# EAGLE design LB_BIT_i36_MICROSEQUENCER-v03(6_7) (EAGLE 6.6.0)
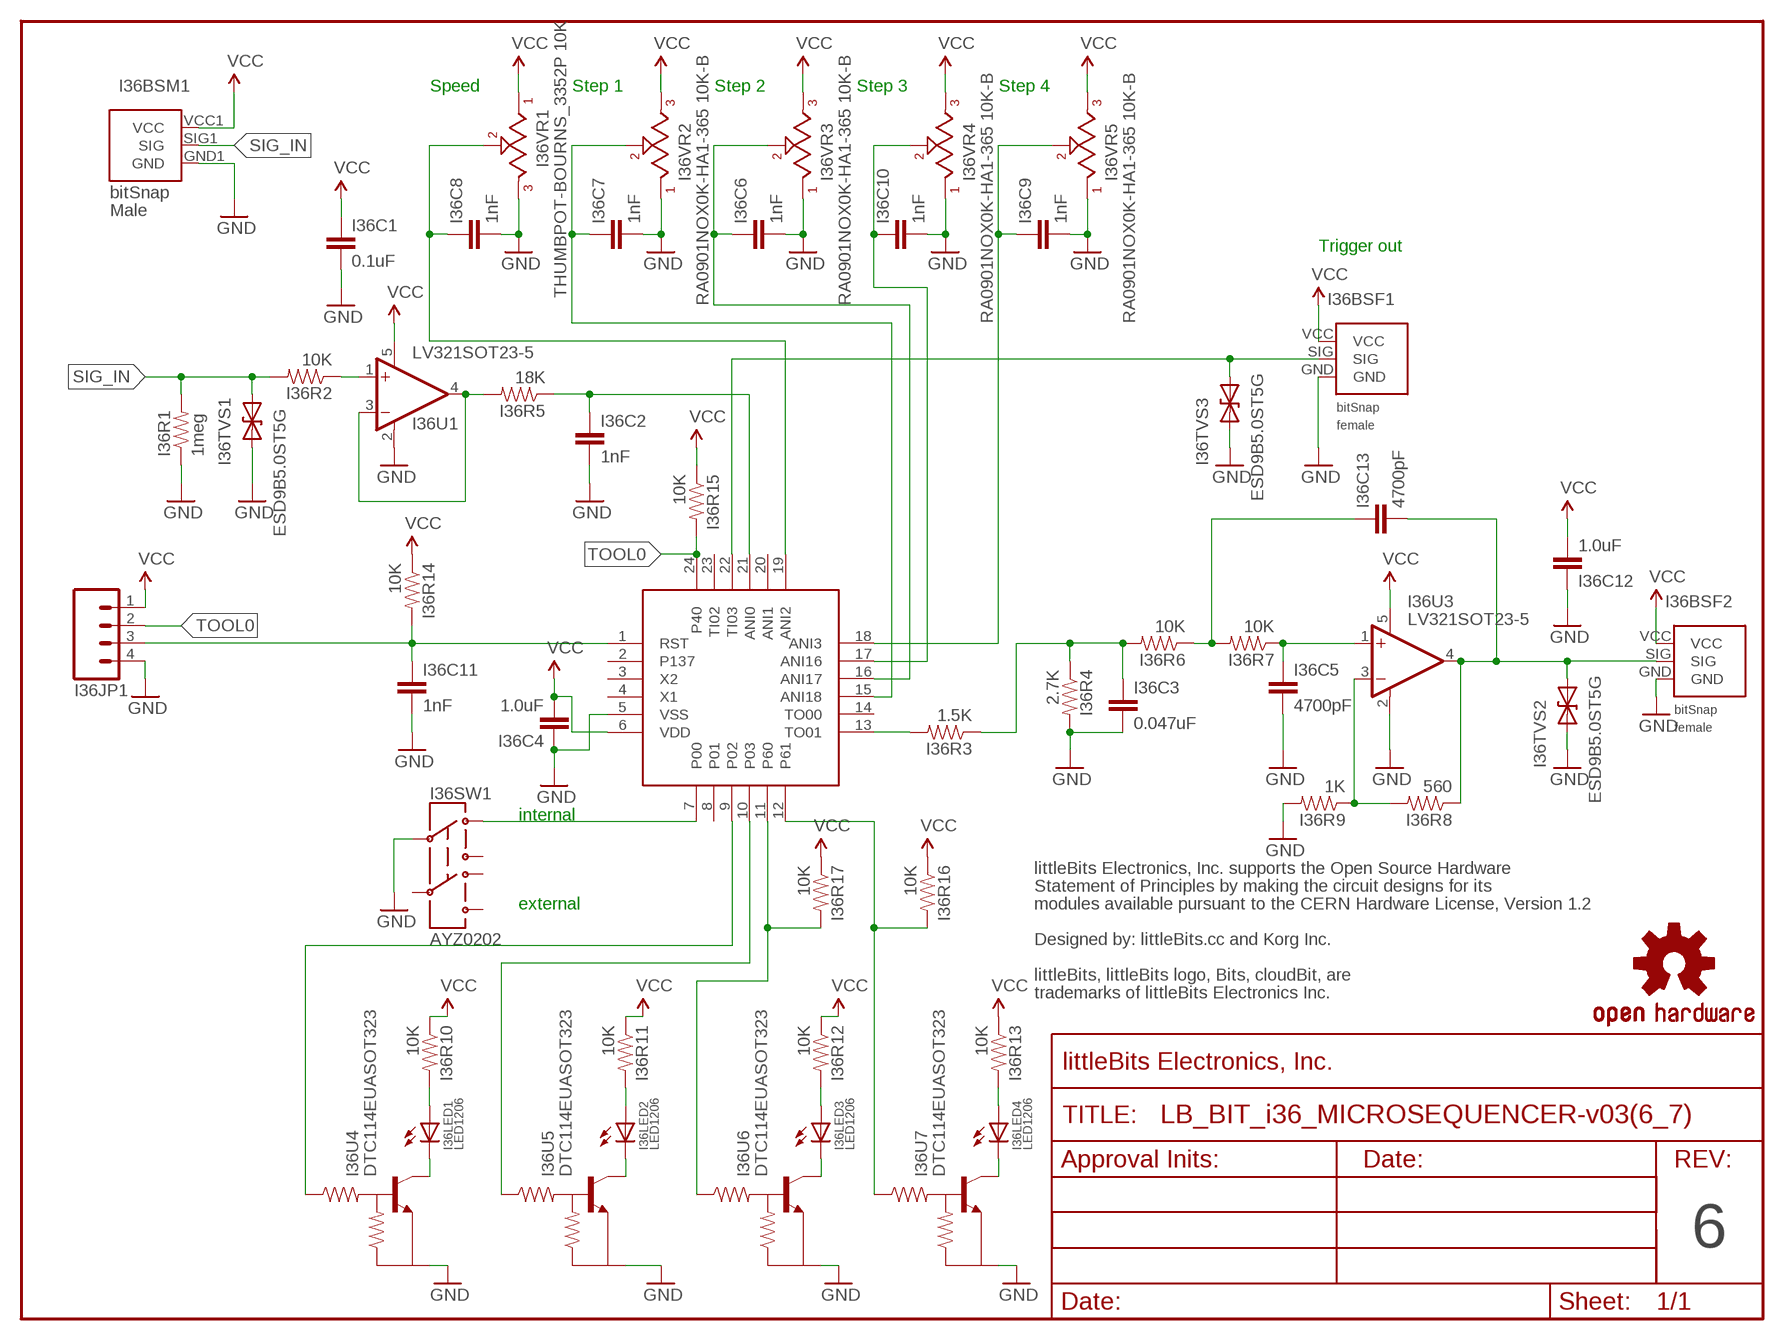
[diagram p0: schematic, sheet 1]

## Parts
I36BSF1  BITSNAP_V03_FEMALE  [BITSNAP_V03_FEMALE]
I36BSF2  BITSNAP_V03_FEMALE  [BITSNAP_V03_FEMALE]
I36BSM1  BITSNAP_V03_MALE  [BITSNAP_V03_MALE]
I36C1  0.1uF  CAPCAP-0603  [CAP-0603]
I36C2  1nF  CAPCAP-0603  [CAP-0603]
I36C3  0.047uF  CAPCAP-0603  [CAP-0603]
I36C4  1.0uF  CAPCAP-0603  [CAP-0603]
I36C5  4700pF  CAPCAP-0603  [CAP-0603]
I36C6  1nF  CAPCAP-0603  [CAP-0603]
I36C7  1nF  CAPCAP-0603  [CAP-0603]
I36C8  1nF  CAPCAP-0603  [CAP-0603]
I36C9  1nF  CAPCAP-0603  [CAP-0603]
I36C10  1nF  CAPCAP-0603  [CAP-0603]
I36C11  1nF  CAPCAP-0603  [CAP-0603]
I36C12  1.0uF  CAPCAP-0603  [CAP-0603]
I36C13  4700pF  CAPCAP-0603  [CAP-0603]
I36JP1  HDR-4SM_SML  [SIP4-SM-0.1IN-NOS.S.]
I36LED1  LED1206  [LED-1206]
I36LED2  LED1206  [LED-1206]
I36LED3  LED1206  [LED-1206]
I36LED4  LED1206  [LED-1206]
I36R1  1meg  RESISTOR0603  [RES-0603]
I36R2  10K  RESISTOR0603  [RES-0603]
I36R3  1.5K  RESISTOR0603  [RES-0603]
I36R4  2.7K  RESISTOR0603  [RES-0603]
I36R5  18K  RESISTOR0603  [RES-0603]
I36R6  10K  RESISTOR0603  [RES-0603]
I36R7  10K  RESISTOR0603  [RES-0603]
I36R8  560  RESISTOR0603  [RES-0603]
I36R9  1K  RESISTOR0603  [RES-0603]
I36R10  10K  RESISTOR0603  [RES-0603]
I36R11  10K  RESISTOR0603  [RES-0603]
I36R12  10K  RESISTOR0603  [RES-0603]
I36R13  10K  RESISTOR0603  [RES-0603]
I36R14  10K  RESISTOR0603  [RES-0603]
I36R15  10K  RESISTOR0603  [RES-0603]
I36R16  10K  RESISTOR0603  [RES-0603]
I36R17  10K  RESISTOR0603  [RES-0603]
I36SW1  AYZ0202  [AYZ0202]
I36TVS1  ESD9B5.0ST5G  DIODE-TVSSOD-923  [SOD-923]
I36TVS2  ESD9B5.0ST5G  DIODE-TVSSOD-923  [SOD-923]
I36TVS3  ESD9B5.0ST5G  DIODE-TVSSOD-923  [SOD-923]
I36U1  LV321SOT23-5  [SOT23-5]
I36U2  R5F10278QFN-24  [QFN-24(4MM)]
I36U3  LV321SOT23-5  [SOT23-5]
I36U4  DTC114EUASOT323  [SOT323]
I36U5  DTC114EUASOT323  [SOT323]
I36U6  DTC114EUASOT323  [SOT323]
I36U7  DTC114EUASOT323  [SOT323]
I36VR1  THUMBPOT-BOURNS_3352P 10K  THUMBPOT-BOURNS_3352P  [THUMBPOT-BOURNS_3352]
I36VR2  RA0901NOX0K-HA1-365 10K-B  ALPS_POTTH  [ALPS_POT]
I36VR3  RA0901NOX0K-HA1-365 10K-B  ALPS_POTTH  [ALPS_POT]
I36VR4  RA0901NOX0K-HA1-365 10K-B  ALPS_POTTH  [ALPS_POT]
I36VR5  RA0901NOX0K-HA1-365 10K-B  ALPS_POTTH  [ALPS_POT]
U$1  OSHWCREDIT-KORG  [OSHWCREDIT-KORG]
U$2  OSHW-LOGOL  [OSHW-LOGO-L]
U$3  FRAME-LETTER-OHWOHW  [FABDWG01-OHW]

## Nets
GND: I36BSF1.GND I36BSF2.GND I36BSM1.GND1(GND) I36C1.2 I36C2.2 I36C3.2 I36C4.1 I36C5.2 I36C6.2 I36C7.2 I36C8.2 I36C9.2 I36C10.2 I36C11.2 I36C12.1 I36JP1.4 I36R1.1 I36R4.2 I36R9.2 I36SW1.2 I36TVS1.1(A) I36TVS2.1(A) I36TVS3.1(A) I36U1.2(V-) I36U2.5(VSS) I36U3.2(V-) I36U4.GND(E) I36U5.GND(E) I36U6.GND(E) I36U7.GND(E) I36VR1.1 I36VR2.1 I36VR3.1 I36VR4.1 I36VR5.1
N$1: I36C2.1 I36R5.1 I36U2.21(ANI0)
N$2: I36R5.2 I36U1.3(-IN) I36U1.4(OUT)
N$3: I36C3.1 I36R3.1 I36R4.1 I36R6.2
N$4: I36R2.1 I36U1.1(+IN)
N$5: I36R3.2 I36U2.13(TO01)
N$6: I36R8.2 I36R9.1 I36U3.3(-IN)
N$7: I36C13.1 I36R6.1 I36R7.2
N$8: I36BSF1.SIG I36TVS3.2(C) I36U2.22(TI03)
N$10: I36C5.1 I36R7.1 I36U3.1(+IN)
N$11: I36SW1.1 I36U2.7(P00)
N$13: I36C7.1 I36U2.15(ANI18) I36VR2.2
N$14: I36C6.1 I36U2.16(ANI17) I36VR3.2
N$15: I36U2.9(P02) I36U4.IN
N$16: I36U2.10(P03) I36U5.IN
N$17: I36R17.2 I36U2.11(P60) I36U6.IN
N$18: I36R16.2 I36U2.12(P61) I36U7.IN
N$19: I36LED1.A I36R10.2
N$20: I36LED1.C I36U4.OUT(C)
N$21: I36LED2.A I36R11.2
N$22: I36LED2.C I36U5.OUT(C)
N$23: I36LED3.A I36R12.2
N$24: I36LED3.C I36U6.OUT(C)
N$25: I36LED4.A I36R13.2
N$26: I36LED4.C I36U7.OUT(C)
N$27: I36C8.1 I36U2.19(ANI2) I36VR1.2
N$28: I36C10.1 I36U2.17(ANI16) I36VR4.2
N$30: I36C9.1 I36U2.18(ANI3) I36VR5.2
N$31: I36C11.1 I36JP1.3 I36R14.2 I36U2.1(RST)
SIG_IN: I36BSM1.SIG1(SIG) I36R1.2 I36R2.2 I36TVS1.2(C)
SIG_OUT: I36BSF2.SIG I36C13.2 I36R8.1 I36TVS2.2(C) I36U3.4(OUT)
TOOL0: I36JP1.2 I36R15.2 I36U2.24(P40)
VCC: I36BSF1.VCC I36BSF2.VCC I36BSM1.VCC1(VCC) I36C1.1 I36C4.2 I36C12.2 I36JP1.1 I36R10.1 I36R11.1 I36R12.1 I36R13.1 I36R14.1 I36R15.1 I36R16.1 I36R17.1 I36U1.5(V+) I36U2.6(VDD) I36U3.5(V+) I36VR1.3 I36VR2.3 I36VR3.3 I36VR4.3 I36VR5.3
Unconnected: I36SW1.3 I36SW1.4 I36SW1.5 I36SW1.6 I36U2.2(P137) I36U2.3(X2) I36U2.4(X1) I36U2.8(P01) I36U2.14(TO00) I36U2.20(ANI1) I36U2.23(TI02)

## Notes on the sheet
- Speed | Step 1 | Step 2 | Step 3 | Step 4
- Trigger out
- internal
- external
- 6

## Library data of the parts
I36BSF1 I36BSF2 = bitSnap:BITSNAP_V03_FEMALE
I36BSM1 = bitSnap:BITSNAP_V03_MALE
I36C1-I36C13 = LITTLEBITS:CAP
I36JP1 = LITTLEBITS:HDR-4: Header 4 Standard 4-pin 0.1" header. Use with straight break away headers (SKU : PRT-00116), right angle break away headers (PRT-00553), swiss pins (PRT-00743), machine pins (PRT-00117), and female headers (PRT-00115). Molex polarized connector foot print use with SKU : PRT-08231 with associated crimp pins and housings.
I36LED1-I36LED4 = LITTLEBITS:LED
I36R1-I36R17 = LITTLEBITS:RESISTOR
I36SW1 = LITTLEBITS:AYZ0202
I36TVS1-I36TVS3 = LITTLEBITS:DIODE-TVS: Bidirectional Transient Voltage Suppression Diode: Device conducts in avalanche mode after reaching a part dependent voltage threshold. Used for limiting voltage spikes on ESD sensitive inputs and outputs.; IEC_ESD_PROT0: +/-18kV; LB_PN: ?; MPN: ESD9B5.0ST5G; V_CLAMP: ?; V_OPERATION: 5V
I36U1 I36U3 = LITTLEBITS:LV321
I36U2 = LITTLEBITS:R5F10278
I36U4-I36U7 = LITTLEBITS:DTC114EUA
I36VR1 = LITTLEBITS:THUMBPOT-BOURNS_3352
I36VR2-I36VR5 = LITTLEBITS:ALPS_POT
U$1 = LITTLEBITS:OSHWCREDIT-KORG
U$2 = LITTLEBITS:OSHW-LOGO: Open Source Hardware Logo This logo indicates the piece of hardware it is found on incorporates a OSHW license and/or adheres to the definition of open source hardware found here: http://freedomdefined.org/OSHW
U$3 = LITTLEBITS:FRAME-LETTER-OHW

## Board
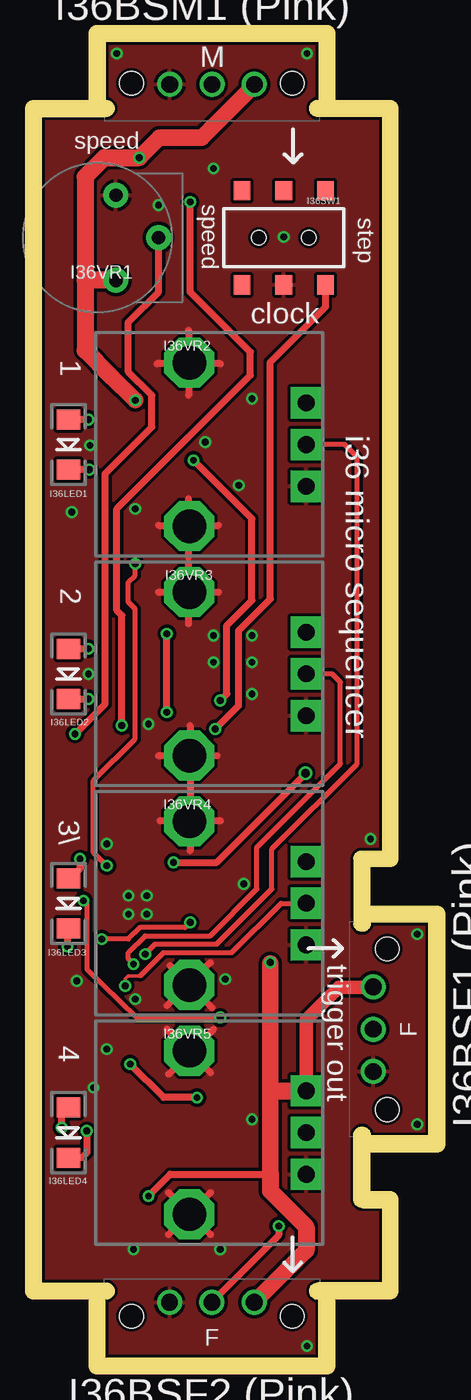
[diagram p1: board, top side]
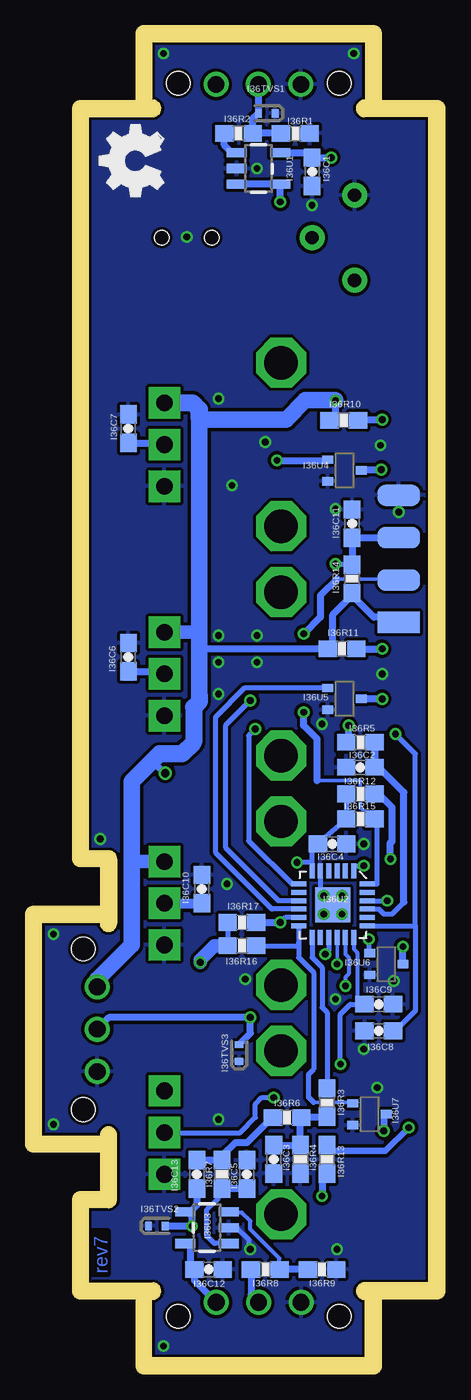
[diagram p2: board, bottom side, seen from below]

Size 23.2 x 78.9 mm. Coordinates in mm from the lower left corner, seen from the top.
Outline: 0,4.5 0,74.4
Outline: 20.4,74.4 20.4,30.4 19.2,30.4 arc90 18.7,29.9
Outline: 20.4,4.5 20.4,9 19.2,9 arc-90 18.7,9.5
Copper layers (1*16): Top 0.035mm / dielectric 1.5mm / Bottom 0.035mm
Design rules "littleBitsDRC": minimum track width 0.2mm, minimum drill 0.4mm, track to track 0.2mm, track to pad 0.2mm, pad to pad 0.2mm, via to via 0.2mm, smd to smd 0mil, copper to edge 0.2mm, drill to drill 0.2mm, minimum pad ring 0.2mm, minimum via ring 0.15mm, stop-mask expansion 0.1mm, vias tented up to drill 0mil, thermal gap 0.2mm
Milling: 9 lines

### Footprints (pad centres in the part's own frame; a part is rotated, then mirrored left to right if it is on the bottom)
BITSNAP_V03_FEMALE = drill 1: GND 3.91,3.33; SIG 6.45,3.33; VCC 8.99,3.33 | hole 1.4: 1.63,2.5; 11.27,2.5
BITSNAP_V03_MALE = drill 1: GND1 8.98,2.56; SIG1 6.44,2.56; VCC1 3.9,2.56 | hole 1.4: 11.27,2.5; 1.63,2.5
CAP-0603 = smd 1.1 x 1: 1 -0.85,0; 2 0.85,0
SIP4-SM-0.1IN-NOS.S. = smd 1.27 x 2.54: 1 -3.81,0; 2 -1.27,0; 3 1.27,0; 4 3.81,0
LED-1206 = smd 1.2 x 1.4: A -1.5,0; C 1.5,0
RES-0603 = smd 1.1 x 1: 1 -0.85,0; 2 0.85,0
AYZ0202 = smd 1 x 1.15: 1 -2.5,2.825; 2 0,2.825; 3 2.5,2.825; 4 -2.5,-2.825; 5 0,-2.825; 6 2.5,-2.825 | hole 0.85: 1.5,0; -1.5,0
SOD-923 = smd 0.4 x 0.5: 1 -0.5,0; 2 0.5,0
SOT23-5 = smd 0.55 x 1.2: 1 -0.95,-1.3; 2 0,-1.3; 3 0.95,-1.3; 4 0.95,1.3; 5 -0.95,1.3
QFN-24(4MM) = smd 0.9 x 0.3: 1 0,3.3; 2 0,2.8; 3 0,2.3; 4 0,1.8; 5 0,1.3; 6 0,0.8; 13 4,0.8; 14 4,1.3; 15 4,1.8; 16 4,2.3; 17 4,2.8; 18 4,3.3 | smd 0.3 x 0.9: 7 0.8,0; 8 1.3,0; 9 1.8,0; 10 2.3,0; 11 2.8,0; 12 3.3,0; 19 3.3,4.1; 20 2.8,4.1; 21 2.3,4.1; 22 1.8,4.1; 23 1.3,4.1; 24 0.8,4.1 | smd 2.1 x 2.1: EP 2.05,2.05
SOT323 = smd 0.5 x 0.65: GND 1.65,-0.65; IN 0.35,-0.65; OUT 1,1.35
THUMBPOT-BOURNS_3352 = drill 0.8 pad 1.5: 1 2.55,-1.1; 2 0,-3.65; 3 -2.55,-1.1
ALPS_POT = drill 1 pad 1.88 square: 1 7,-2.5; 2 7,0; 3 7,2.5 | drill 2 octagon: LUG1 0,-4.9; LUG2 0,4.9

### Placement (x,y rotation side)
I36BSF1  23.2,13.25 90 top
I36BSF2  3.75,0 0 top
I36BSM1  16.65,78.9 180 top
I36C1  7,71.1 270 bottom
I36C2  4.1,35.4 180 bottom
I36C3  9.3,11.9 270 bottom
I36C4  5.8,30.8 180 bottom
I36C5  10.9,11 90 bottom
I36C6  18,42 90 bottom
I36C7  18,55.7 90 bottom
I36C8  3,19.6 180 bottom
I36C9  3,21.2 0 bottom
I36C10  13.6,28.1 90 bottom
I36C11  4.6,50 90 bottom
I36C12  13.2,5.3 180 bottom
I36C13  13.9,11 270 bottom
I36JP1  1.8,47.9 90 bottom
I36LED1  1.6,54.75 270 top
I36LED2  1.6,41 270 top
I36LED3  1.6,27.25 270 top
I36LED4  1.6,13.5 270 top
I36R1  8,73.4 180 bottom
I36R2  11.4,73.4 0 bottom
I36R3  6.1,15.3 90 bottom
I36R4  7.7,11.9 270 bottom
I36R5  4.1,36.9 180 bottom
I36R6  8.5,14.4 0 bottom
I36R7  12.4,11 90 bottom
I36R8  9.8,5.3 0 bottom
I36R9  6.4,5.3 0 bottom
I36R10  5.1,56.2 0 bottom
I36R11  5.2,42.5 0 bottom
I36R12  4.1,33.8 0 bottom
I36R13  6.1,11.9 90 bottom
I36R14  4.6,46.7 90 bottom
I36R15  4.1,32.3 0 bottom
I36R16  11.2,24.7 0 bottom
I36R17  11.2,26.1 0 bottom
I36SW1  14.5,67.15 180 top
I36TVS1  9.7,74.6 180 bottom
I36TVS2  16.3,7.9 0 bottom
I36TVS3  11.38,18.27 90 bottom
I36U1  10.2,71.3 270 bottom
I36U2  7.8,29.2 270 bottom
I36U3  13.3,7.8 90 bottom
I36U4  5.4,54.2 270 bottom
I36U5  5.4,40.5 270 bottom
I36U6  2.9,24.6 270 bottom
I36U7  3.9,15.6 270 bottom
I36VR1  3.35,67.15 90 top
I36VR2  8.85,54.75 0 top
I36VR3  8.85,41 0 top
I36VR4  8.85,27.25 0 top
I36VR5  8.85,13.5 0 top
U$1  3.95,-45.65 0 top  (outside the outline)
U$2  46.7,-43.5 0 top  (outside the outline)
U$3  80.55,23.85 0 top  (outside the outline)
U$17  [OSHW_FILLX150_NOTEXT]  15.91,68.81 0 top

### Tracks (layer width: path | path; a pad name or v marks a point on that pad's centre or on a via)
GND  (via drill 0.41)
  Top 0.406: 10.7,59.6 6.9,59.6 | 8.8,61.6 8.8,57.7 | 8.9,37.9 8.9,30.4 | 7,49.9 10.6,49.9 | 7,45.9 10.6,45.9 | 8.8,48 8.8,51.5 | 8.8,44 8.8,47.7 | 7,36.1 10.5,36.1 | 7.1,32.2 10.7,32.2 | 7.5,21.1 10.1,23.7 | 10.2,21 7.7,23.5 | 7.5,19.7 10.1,17.1 | 7.6,17 10.3,19.7 | 7.6,9.9 10.1,7.4 | 10.1,9.9 7.6,7.4
  Bottom 0.3: I36U2.5 6.5,27.9
  Bottom 0.305: I36U3.2 11.5,7.8 10.8,7.1 10.8,6.6 v10.7,6.5
  other vias: 12.6,14.3 5.5,6.5 3.1,16.2 2.1,22.6 10.3,71.3 5.6,50.9 1.8,50.7 6.4,38 5.2,26.6 6.3,26.6 6.3,27.7 5.2,27.7 3.9,30.8 19.7,31.1 3.9,18.5 11,22.7 12.1,28.4 22.5,25.4 22.5,14 15.9,0.7 4.5,78.2 15.9,78.2 7,69.1 10.3,41.7 10.3,43.3 9.8,54.9 12.6,57.5 2.8,41 2.9,54.7 12.6,39.8 14.5,67.2 12.6,41.7 12.6,43.3 11.8,52.3 5.6,21.5
  pour Bottom: 0,0 0,78.9 23.2,78.9 23.2,0
  pour Top: 0,0 0,78.9 23.2,78.9 23.2,0
N$1
  Bottom 0.3: I36U2.21 3,26.9 2.7,26.6 2.2,26.6 1.5,27.3
  Bottom 0.406: I36R5.1 I36C2.1 3,35.4 1.5,33.9 1.5,27.3
N$2  (via drill 0.41)
  Top 0.406: v4.8,37.9 4.8,44.5 4.5,44.8 4.5,50.9 12.5,58.9 12.5,60.3 8.9,63.9 v8.9,69.3
  Bottom 0.406: I36U1.4 I36U1.3 | I36R5.2 4.8,37.05 v4.8,37.9 | v8.9,69.3 I36U1.4 | I36U1.4
N$3
  Bottom 0.406: I36C3.1 I36R4.1 7.7,14.35 I36R6.2 6.15,14.4 I36R3.1
N$4
  Bottom 0.254: I36U1.1 11.8,72.25
  Bottom 0.406: 11.8,72.25 12.25,72.7 I36R2.1
N$5
  Bottom 0.3: I36U2.13 7,24 6.4,23.4 6.4,21 6.1,20.7 I36R3.2
N$6
  Bottom 0.254: 8.95,5.45 8.95,5.96 10.7,7.7 10.7,8.2 11.2,8.7 11.95,8.7
  Bottom 0.305: 11.95,8.7 I36U3.3
  Bottom 0.406: I36R9.1 I36R8.2 8.95,5.45
N$7
  Bottom 0.406: I36R6.1 9.6,14.2 10.9,12.9 11.6,12.9 12.4,12.1 I36R7.2 I36C13.1
N$8  (via drill 0.41)
  Top 0.305: v2.5,27.4 2.7,27.2 2.7,23.3 5.7,20.4 v10.7,20.4
  Bottom 0.3: I36U2.22 v2.5,27.4
  Bottom 0.406: I36BSF1.SIG 19.17,20.4 v10.7,20.4 10.7,19.45 I36TVS3.2
N$10
  Bottom 0.305: I36U3.1 12.85,6.85 13.3,7.3 13.3,8.9 12.6,9.6 12.6,9.95 I36R7.1
  Bottom 0.406: I36R7.1 I36C5.1 arc-90 11.1,9.95
N$11  (via drill 0.41)
  Top 0.406: v10.4,37.7 11.8,39.1 11.8,43.6 13.7,45.5 13.7,59.7 17,63 I36SW1.1
  Bottom 0.3: I36U2.7 8.2,28.4 10.8,31 10.8,37.3 v10.4,37.7
N$13  (via drill 0.41)
  Top 0.3: v6.2,24.2 6.8,24.8 10.5,24.8 13.8,28.1 13.8,30.5 18.9,35.6 18.9,54 18.15,54.75
  Top 0.305: 18.15,54.75 I36VR2.2
  Bottom 0.3: I36U2.15 6,24.4 v6.2,24.2
  Bottom 0.406: I36C7.1 15.95,54.85 I36VR2.2
N$14  (via drill 0.41)
  Top 0.3: v5.5,23.6 5.2,23.9 5.2,24.3 6.2,25.3 10.1,25.3 12.9,28.1 12.9,30.6 17.9,35.6 17.9,40.5 17.4,41
  Top 0.305: 17.4,41 I36VR3.2
  Bottom 0.2: I36U2.16 v5.5,23.6
  Bottom 0.305: 16.1,41.15 16,41.15 I36VR3.2
  Bottom 0.406: I36C6.1 16.1,41.15
N$15  (via drill 0.41)
  Top 0.406: v9.1,53.8 12.6,50.3 12.6,45.4 11.1,43.9 11.1,39.8 v10.7,39.4
  Bottom 0.3: I36U2.9 9,27.4 12.2,30.6 12.2,37.9 v10.7,39.4 | 6,53.8 I36U4.IN
  Bottom 0.406: v9.1,53.8 6,53.8
N$16
  Bottom 0.3: I36U2.10 9.4,26.9 12.8,30.3 12.8,38.4 11.05,40.15 I36U5.IN
N$17  (via drill 0.41)
  Top 0.3: v8.9,26.1 8.6,25.8 5.9,25.8 5.2,25.1 v3.6,25.1
  Bottom 0.3: I36U2.11 8.6,26.4 v8.9,26.1 | v3.6,25.1 3.6,24.3 I36U6.IN
  Bottom 0.406: I36R17.2 v8.9,26.1
N$18
  Bottom 0.2: I36U7.IN 4.3,15.3 6.9,15.3
  Bottom 0.3: I36U2.12 7.8,24.9 7.8,24 6.9,23.1 6.9,17.3 7.2,17 7.2,15.6 6.9,15.3
  Bottom 0.305: I36R16.2 7.8,24.7 7.8,24.9
N$19  (via drill 0.41)
  Top 0.406: v2.8,56.25 I36LED1.A
  Bottom 0.406: I36R10.2 4.1,56.3 4.05,56.25 v2.8,56.25
N$20  (via drill 0.41)
  Top 0.406: v2.85,53.25 I36LED1.C
  Bottom 0.406: I36U4.OUT 4.1,53.2 4.15,53.25 v2.85,53.25
N$21  (via drill 0.41)
  Top 0.406: v2.8,42.5 I36LED2.A
  Bottom 0.406: I36R11.2 v2.8,42.5
N$22  (via drill 0.41)
  Top 0.406: I36LED2.C v2.8,39.5
  Bottom 0.406: v2.8,39.5 I36U5.OUT
N$23  (via drill 0.41)
  Top 0.406: I36LED3.A 1.85,28.85 1.8,29 1.95,29 2.3,29.35 v2.3,29.9
  Bottom 0.406: v2.3,29.9 2.3,30.9 arc-90 2.2,31 2.2,33 3.1,33.9 I36R12.2
N$24  (via drill 0.41)
  Top 0.406: v1.55,24.65 1.55,25.75 I36LED3.C
  Bottom 0.406: I36U6.OUT v1.55,24.65
N$25  (via drill 0.41)
  Top 0.406: v1.2,13.8 1.2,15 I36LED4.A
  Bottom 0.4: I36R13.2 5.95,12.5 5.9,12.5 5.8,12.4 2.6,12.4 v1.2,13.8
N$26  (via drill 0.41)
  Top 0.406: v2.7,13.6 2.7,12.3 2.4,12 I36LED4.C
  Bottom 0.406: I36U7.OUT 2.7,14.55 v2.7,13.6
N$27  (via drill 0.41)
  Top 0.406: v2,37.4 3.8,39.2 3.8,53 6.6,55.8 6.6,57.7 5.2,59.1 5.2,62.1 7,63.9 I36VR1.2
  Bottom 0.3: I36U2.19 0.8,25.9 | 0.8,25.9 0.8,36.2 v2,37.4 | 0.8,25.9 0.8,20.8 1.7,19.9 1.85,19.9 I36C8.1
N$28  (via drill 0.41)
  Top 0.203: v5,22.3 5,22.7 5.2,22.9 5.9,22.9
  Top 0.3: 5.9,22.9 7.3,24.3 11.4,24.3 14.35,27.25
  Top 0.305: 14.35,27.25 I36VR4.2
  Bottom 0.254: I36U2.17 5,24.2 4.8,24 4.8,23 5,22.8 v5,22.3
  Bottom 0.61: I36VR4.2 I36C10.1
N$30  (via drill 0.41)
  Top 0.406: v9.3,15.6 7.3,15.6 v5.3,17.6
  Bottom 0.254: I36U2.18 4.5,24.5 4.3,24.3 4.3,21.4 4.1,21.2
  Bottom 0.3: 15.4,13.5 11.3,13.5 10.4,14.4 10.4,15.2 10,15.6 v9.3,15.6 | v5.3,17.6 5.3,20.6 4.7,21.2 4.1,21.2 I36C9.1
  Bottom 0.305: 15.4,13.5 I36VR5.2
N$31  (via drill 0.41)
  Top 0.3: v3.9,29.5 3.1,30.3 3.1,34.6 5.6,37.1 5.6,44.9 5.2,45.3 5.2,46.5 5.6,46.9 v5.6,47.6
  Bottom 0.3: I36U2.1 4.5,29.5 v3.9,29.5 | v5.6,47.6 4.65,47.6 I36R14.2
  Bottom 0.406: I36R14.2 I36C11.1 4.58,49.17 I36JP1.3
SIG_IN
  Bottom 0.254: I36BSM1.SIG1
  Bottom 0.406: I36BSM1.SIG1 I36TVS1.2 10.55,74.3 I36R2.2 I36R1.2
SIG_OUT  (via drill 0.41)
  Top 0.406: v14.2,7.9 14.2,7.33 I36BSF2.SIG
  Bottom 0.406: I36C13.2 13.9,9.15 14.4,8.65 | 14.4,8.65 arc-90 I36U3.4 | I36R8.1 10.65,3.78 I36BSF2.SIG | 14.4,8.65 14.2,8.65 v14.2,7.9 I36TVS2.2
TOOL0  (via drill 0.41)
  Top 0.406: v7.5,38.7 v7.5,43.4
  Bottom 0.2: I36R15.2 4.1,32.95 4.1,34.6 6.7,34.6 | I36JP1.2 1.87,46.7 5.5,46.7
  Bottom 0.3: I36U2.24 3.1,28.4 3.1,31.8 3.3,32.05 I36R15.2
  Bottom 0.406: 6.7,34.6 6.7,37.1 7.5,37.9 v7.5,38.7 | 5.5,46.7 6.5,45.7 6.5,44.4 v7.5,43.4
VCC  (via drill 0.41, 0.5)
  Top 0.406: v6.4,9.7 7.7,11 13.7,11 | v7.9,29.7 10.5,29.7 15.8,35 v15.8,35.05
  Top 0.813: v13.7,23.7 13.7,23.65 | I36VR5.3 15.85,20.25 17.8,22.2 19.83,22.2 I36BSF1.VCC
  Top 1: 13.7,11 13.7,16 13.7,23.65 | v5.85,71.95 7.05,73.15 9.6,73.15 12.75,76.3 I36BSM1.VCC1 | 4.15,58.85 v5.6,57.4 | 15.85,6.44 I36BSF2.VCC
  Top 1.016: v5.85,71.95 3.75,71.95 2.6,70.8 2.6,64.6 | 4.15,58.85 2.6,60.4 2.6,64.6 | 13.7,16 I36VR5.3 | 13.7,11 13.7,10 15.85,7.85 15.85,6.44 | I36VR1.3 2.6,64.6
  Bottom 0.254: 7.35,72.25 I36C1.1
  Bottom 0.3: I36U2.6 7,29.7 | 7,30.65 6.95,30.7 I36C4.2 5.15,32.1 I36R15.1 I36R12.1 | 7,29.7 v7.9,29.7 | 7,29.7 7,30.45
  Bottom 0.305: I36R16.1 I36R17.1 12.05,24.75 12.1,24.7 | 12.7,24.7 v13.7,23.7
  Bottom 0.4: I36R13.1 6.1,11.1 | 7,30.45 I36C4.2
  Bottom 0.406: I36U1.5 7.35,72.25 | I36C1.1 v5.85,71.95 | 13.75,42.5 I36R11.1 5.75,42.7 5.75,44.55 4.7,45.6 I36R14.1 4.6,45.7 3.3,44.4 2.11,44.4 I36JP1.1 | I36BSF2.VCC 14.05,4.64 I36C12.2 14.3,5.5 14.3,6.8 14.45,6.8 14.5,6.85 I36U3.5 | 6.1,11.1 6.4,10.8 v6.4,9.7 | v5.6,57.4 5.6,56.25 I36R10.1 | v15.8,35.05 15.85,35.05 16.58,35.77
  Bottom 0.813: I36R16.1 12.1,24.7 12.85,24.7 13.71,23.85 v13.7,23.7 | I36VR3.3 13.85,43.5 13.75,43.6 | I36VR4.3 17.75,29.75 17.8,29.7
  Bottom 1: 13.75,39.7 13.75,42.5 13.75,43.6 13.75,56.25 8.55,56.25 7.4,57.4 v5.6,57.4 | 17.8,34.55 17.8,29.7 17.8,24.75 19.87,22.68 I36BSF1.VCC
  Bottom 1.016: I36VR2.3 14.15,57.25 13.75,56.85 13.75,56.25 | 13.75,39.7 13.75,39.35 14.1,39 14.1,36.9 14.8,36.2 16.15,36.2 16.58,35.77 17.8,34.55

### Text on the board
Bottom: rev7
tPlace: speed | speed | step | clock | 1 | i36 micro sequencer | 2 | 3\ | trigger out | 4
tNames: I36BSM1 (Pink) | I36BSF1 (Pink) | I36BSF2 (Pink)
Milling: 1MM ROUTER PATH
dxf: 7